# Altium schematic sheet Control_Sense_TOPMOS.SchDoc (part 1 of 4)
size A2 portrait; SheetNumber: 3; SheetTotal: 5
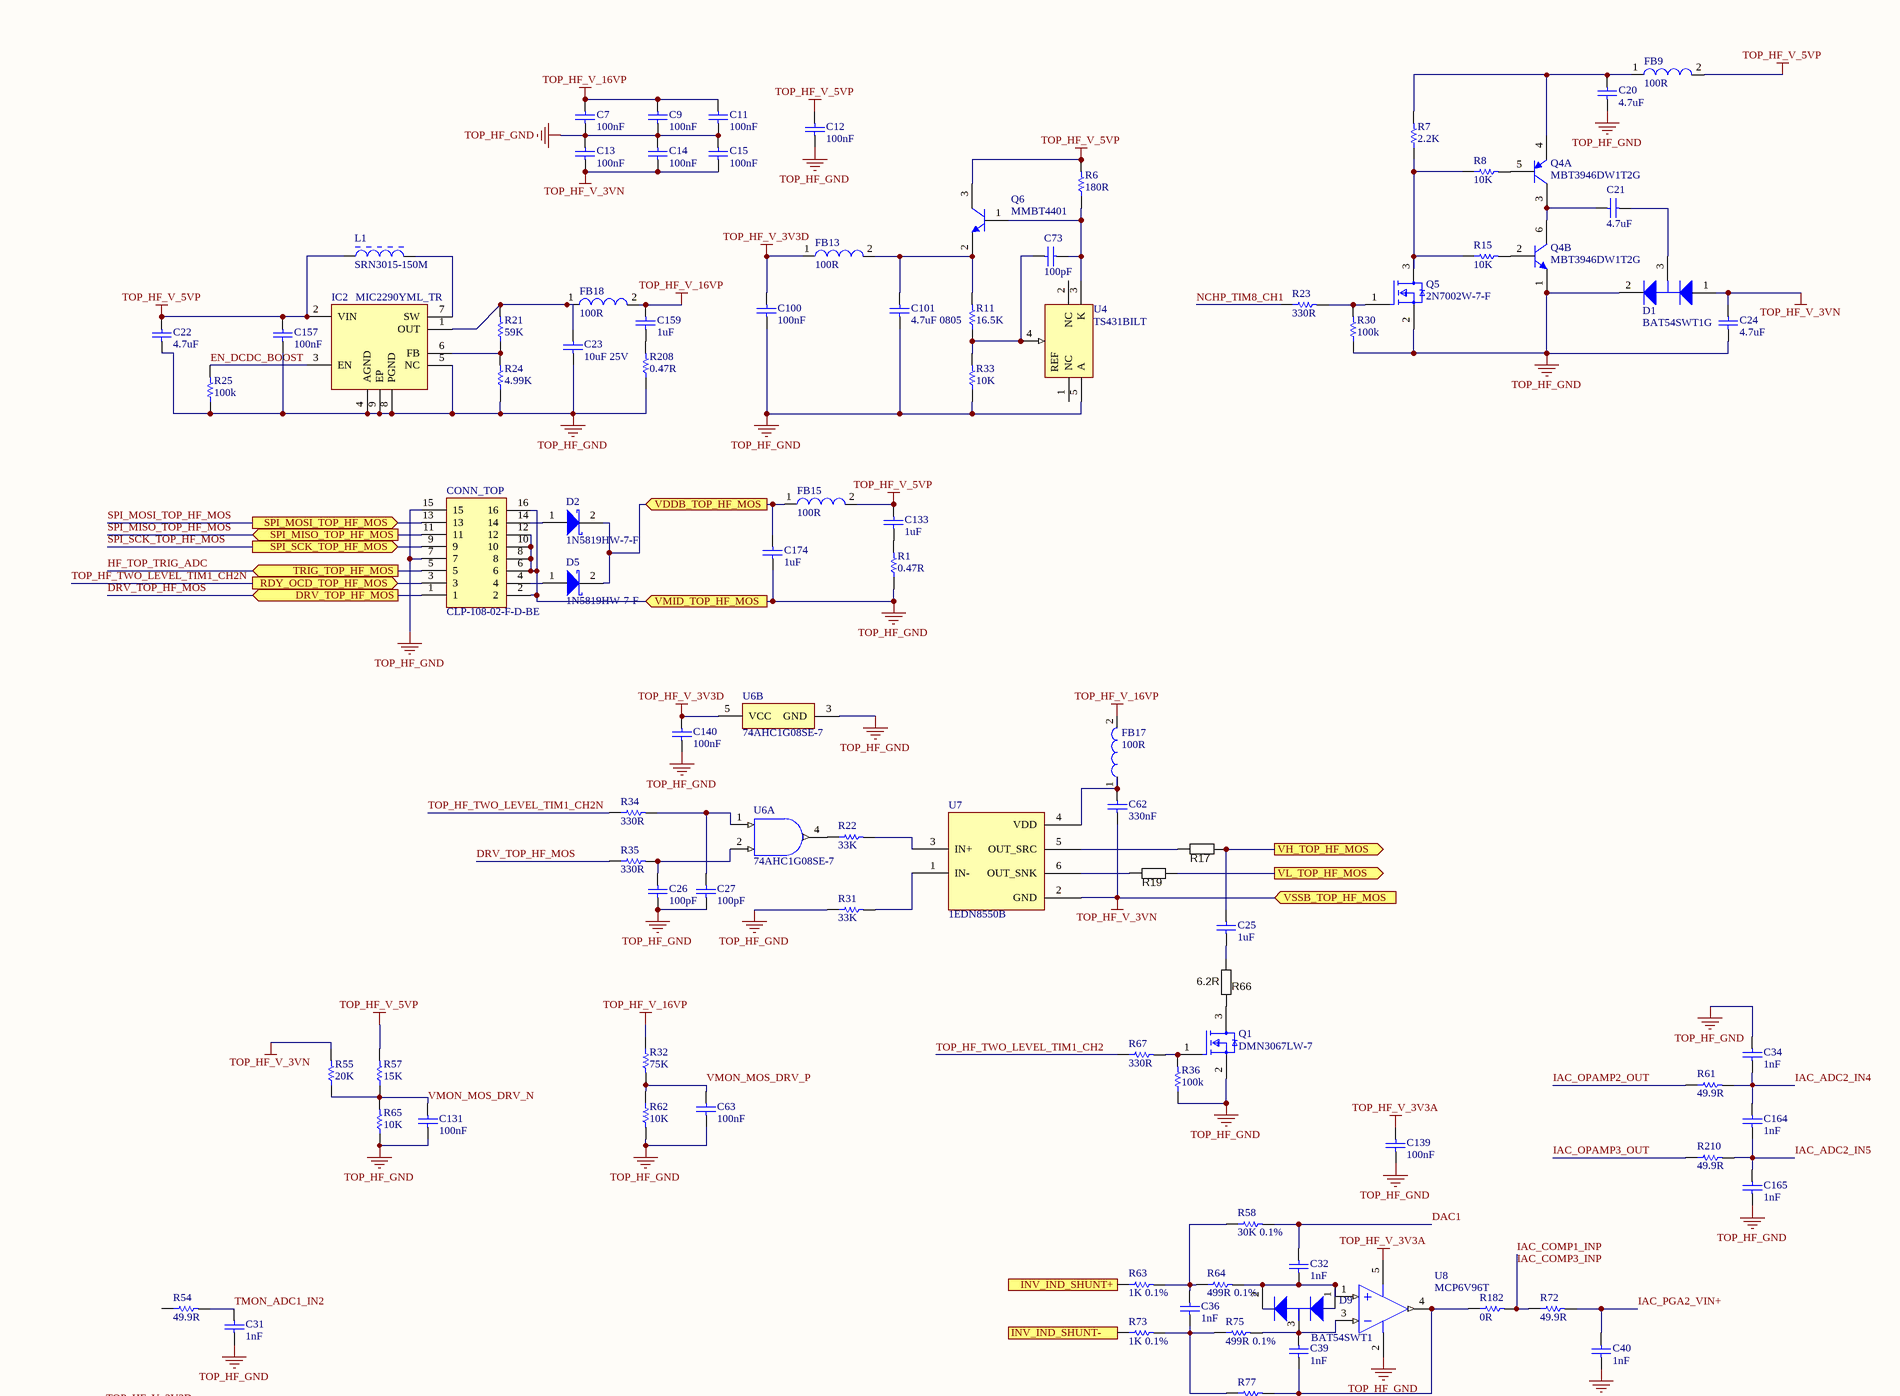
[diagram p0: Control_Sense_TOPMOS.SchDoc, top]
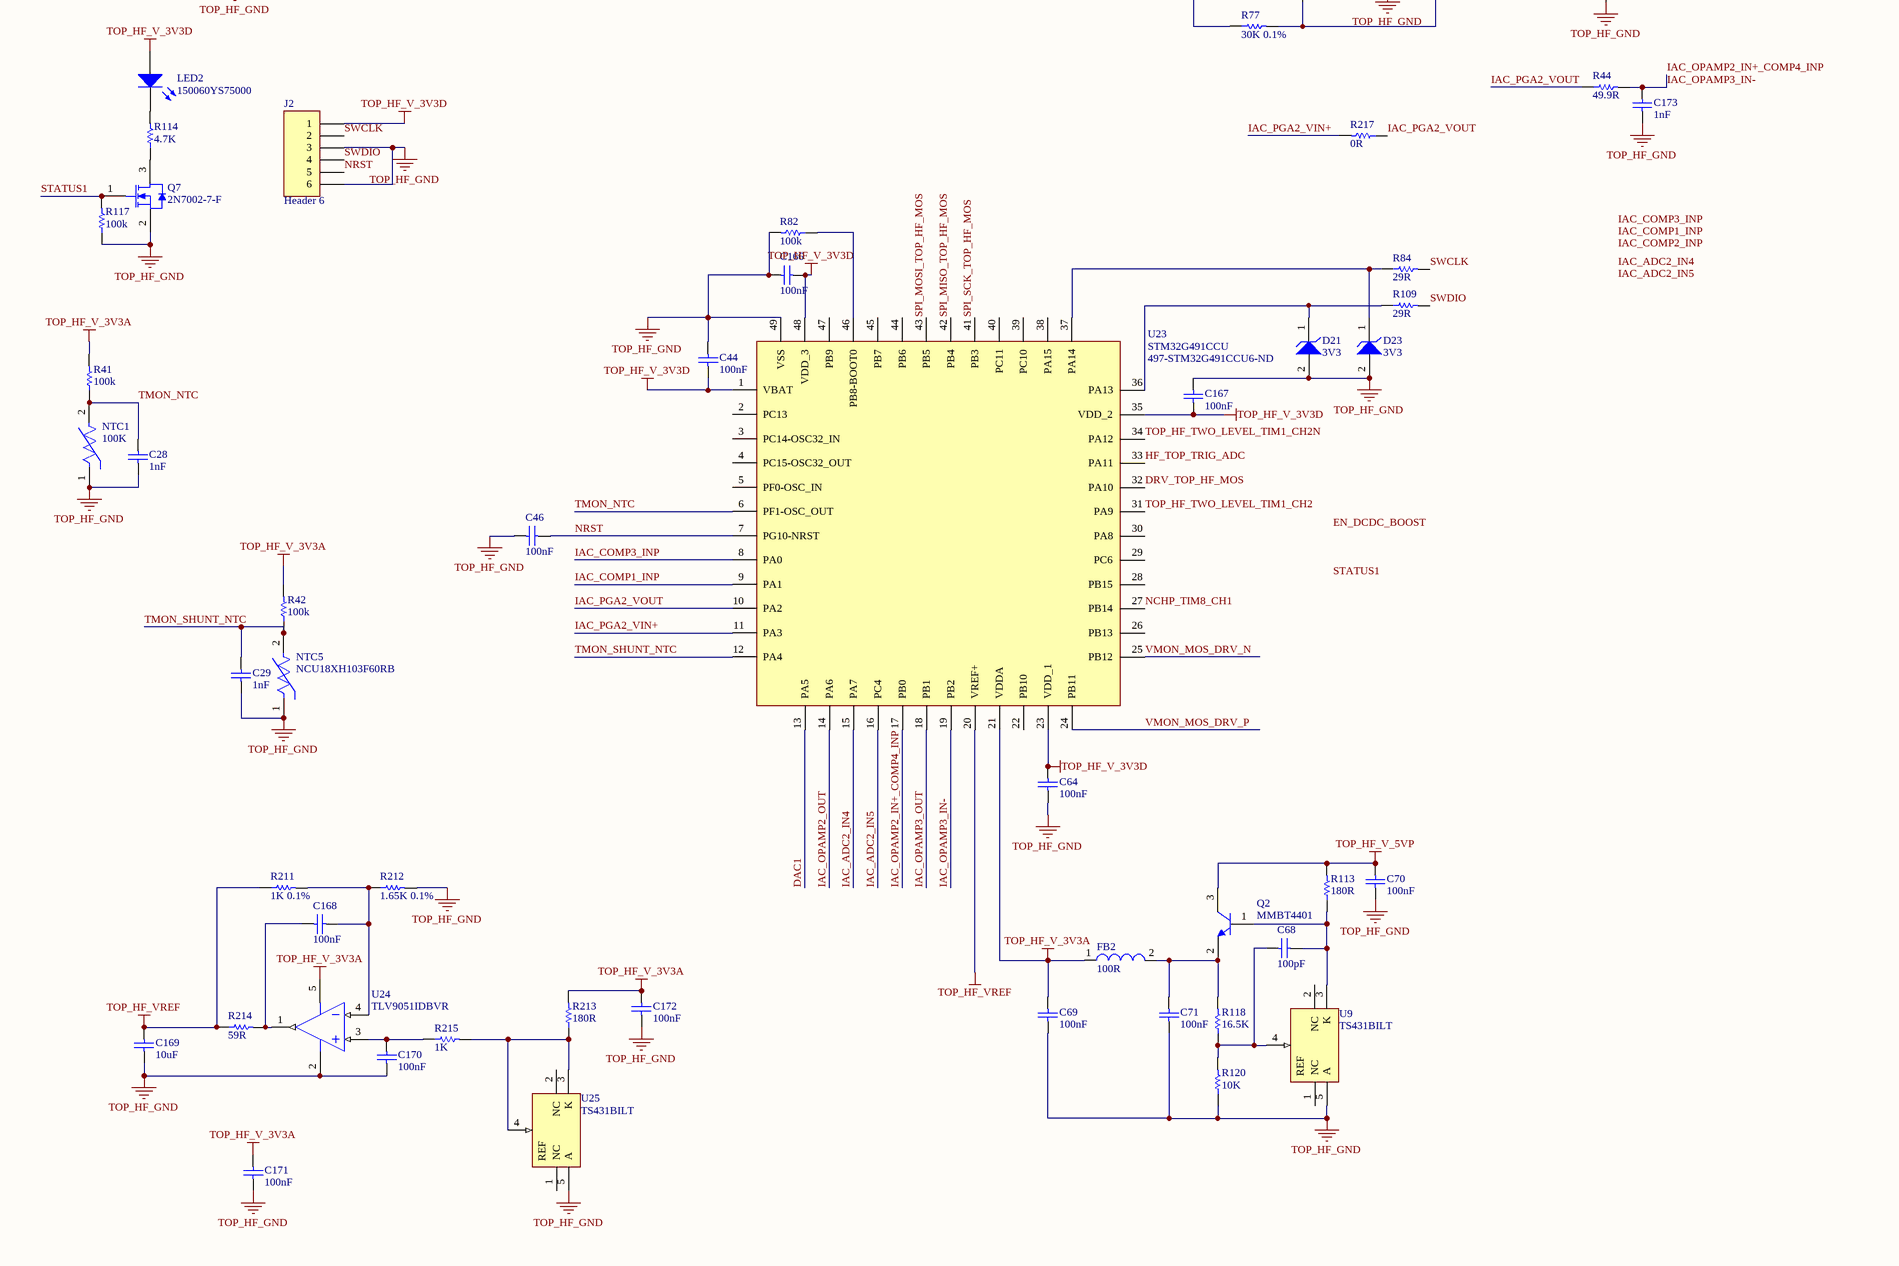
[diagram p1: Control_Sense_TOPMOS.SchDoc, bottom]

## Parts
C7  100nF  [CAPC1608X90X35ML15T15]
C9  100nF  [CAPC1608X90X35ML15T15]
C11  100nF  [CAPC1608X90X35NL15T15]
C12  100nF  [CAPC1608X90X35NL15T15]
C13  100nF  [CAPC1608X90X35ML15T15]
C14  100nF  [CAPC1608X90X35ML15T15]
C15  100nF  [CAPC1608X90X35NL15T15]
C20  4.7uF  [SAMS-C0603-2_L]
C21  4.7uF  [SAMS-C0603-2_L]
C22  4.7uF  [CAPC2013X145X20NL20]
C23  10uF 25V  [CAPC3216X229X50LL20T25]
C24  4.7uF  [SAMS-C0603-2_L]
C25  1uF  [CAPC2013X135X45ML10T25]
C26  100pF  [CAPC1608X90X35NL10T15]
C27  100pF  [CAPC1608X90X35NL10T15]
C28  1nF  [CAPC1005X56X25NL10T15]
C29  1nF  [CAPC1005X56X25NL10T15]
C31  1nF  [CAPC1005X56X25LL10T15]
C32  1nF  [CAPC1608X90X35NL15T15]
C34  1nF  [CAPC1005X56X25LL10T15]
C36  1nF  [CAPC1608X90X35LL15T15]
C39  1nF  [CAPC1608X90X35NL15T15]
C40  1nF  [CAPC1005X56X25LL10T15]
C44  100nF  [SAMS-C0603-2_N]
C46  100nF  [CAPC1005X56X25NL10T15]
C62  330nF  [CAPC2013X135X45NL10T25]
C63  100nF  [CAPC1005X56X25NL10T15]
C64  100nF  [SAMS-C0603-2_N]
C68  100pF  [CAPC1608X90X35NL10T15]
C69  100nF  [SAMS-C0603-2_L]
C70  100nF  [SAMS-C0603-2_N]
C71  100nF  [SAMS-C0603-2_N]
C73  100pF  [CAPC1608X90X35NL10T15]
C100  100nF  [SAMS-C0603-2_N]
C101  4.7uF 0805  [CAPC2013X145X20NL20]
C131  100nF  [CAPC1005X56X25NL10T15]
C133  1uF  [CAPC2013X140X50LL20T25]
C139  100nF  [SAMS-C0603-2_N]
C140  100nF  [CAPC1608X90X35LL15T15]
C157  100nF  [CAPC1608X90X35LL15T15]
C159  1uF  [CAPC2013X140X50LL20T25]
C164  1nF  [CAPC1005X56X25LL10T15]
C165  1nF  [CAPC1005X56X25LL10T15]
C166  100nF  [SAMS-C0603-2_N]
C167  100nF  [SAMS-C0603-2_N]
C168  100nF  [SAMS-C0603-2_L]
C169  10uF  [CAPC1608X90X35LL15T15]
C170  100nF  [SAMS-C0603-2_L]
C171  100nF  [SAMS-C0603-2_L]
C172  100nF  [SAMS-C0603-2_N]
C173  1nF  [CAPC1005X56X25LL10T15]
C174  1uF  [CAPC2013X140X50LL20T25]
CONN_TOP  CLP-108-02-F-D-BE  [CLP-108-02-XXX-D-BE]
D1  BAT54SWT1G  [ONSC-SOT-323-3-419-04_V]
D2  1N5819HW-7-F  [DIOD-SOD-123-2_V]
D5  1N5819HW-7-F  [DIOD-SOD-123-2_V]
D9  BAT54SWT1  [ONSC-SOT-323-3-419-04_V]
D21  3V3  [ONSC-SOD-523-2-502-01_V]
D23  3V3  [ONSC-SOD-523-2-502-01_V]
FB2  100R  [SMD-0603]
FB9  100R  [SMD-0603]
FB13  100R  [SMD-0603]
FB15  100R  [SMD-0603]
FB17  100R  [SMD-0603]
FB18  100R  [SMD-0603]
IC2  MIC2290YML_TR  [SON50P200X200X95-9N-D]
J2  Header 6  [HDR1X6]
L1  SRN3015-150M  [BOUR-SRN3015-2_V]
LED2  150060YS75000  [0603_A]
NTC1  100K  [FP-NXR_151B030-MFG]
NTC5  NCU18XH103F60RB  [FP-NCU18-0_15-MFG]
Q1  DMN3067LW-7  [FP-SOT323-IPC_C]
Q2  MMBT4401  [SOT23-3]
Q4  MBT3946DW1T2G  [ONSC-SC70-6-419B-02_W_V]  (parts A,B of 2)
Q5  2N7002W-7-F  [FP-SOT323-IPC_B]
Q6  MMBT4401  [SOT23-3]
Q7  2N7002-7-F  [DIOD-SOT23-3_V]
R1  0.47R  [RESC1608X55X25ML10T15]
R6  180R  [RESC1608X55X25LL10T15]
R7  2.2K  [RESC1608X55X25NL10T15]
R8  10K  [RESC1608X55X30NL20T10]
R11  16.5K  [RESC1608X55X30NL15T15]
R15  10K  [RESC1608X55X30NL20T10]
R17  RES_EMPTY_0805  [RESC2012X70N]  (value not drawn)
R19  RES_EMPTY_0805  [RESC2012X70N]  (value not drawn)
R21  59K  [RESC1608X55X30NL15T15]
R22  33K  [RESC1005X40X25ML05T05]
R23  330R  [RESC1608X55X25NL10T15]
R24  4.99K  [RESC1609X50X30NL10T20]
R25  100k  [RESC1608X55X30NL15T15]
R30  100k  [RESC1608X55X30NL15T15]
R31  33K  [RESC1005X40X25ML05T05]
R32  75K  [RESC1608X55X30NL15T15]
R33  10K  [RESC1609X55X30LL15T15]
R34  330R  [RESC1608X55X25NL10T15]
R35  330R  [RESC1608X55X25NL10T15]
R36  100k  [RESC1608X55X30NL15T15]
R41  100k  [RESC1608X55X30NL15T15]
R42  100k  [RESC1608X55X30NL15T15]
R44  49.9R  [RESC1005X40X25NL05T05]
R54  49.9R  [RESC1005X40X25NL05T05]
R55  20K  [RESC1608X55X30NL20T10]
R57  15K  [RESC1608X55X30NL20T10]
R58  30K 0.1%  [RESC1608X55N]
R61  49.9R  [RESC1005X40X25NL05T05]
R62  10K  [RESC1608X55X30NL20T10]
R63  1K 0.1%  [RESC1608X55X25NL10T15]
R64  499R 0.1%  [RESC1608X55N]
R65  10K  [RESC1608X55X30NL20T10]
R66  6.2R  [RESC2012X70N]
R67  330R  [RESC1608X55X25NL10T15]
R72  49.9R  [RESC1005X40X25NL05T05]
R73  1K 0.1%  [RESC1608X55X25NL10T15]
R75  499R 0.1%  [RESC1608X55N]
R77  30K 0.1%  [RESC1608X55N]
R82  100k  [RESC1608X55X30NL15T15]
R84  29R  [RESC1608X55X30NL20T10]
R109  29R  [RESC1608X55X30NL20T10]
R113  180R  [RESC1608X55X25LL10T15]
R114  4.7K  [RESC1608X55X25ML10T15]
R117  100k  [RESC1608X55X25ML10T15]
R118  16.5K  [RESC1608X55X30NL15T15]
R120  10K  [RESC1609X55X30LL15T15]
R182  0R  [RESC1608X55X25NL10T15]
R208  0.47R  [RESC1608X55X25ML10T15]
R210  49.9R  [RESC1005X40X25NL05T05]
R211  1K 0.1%  [RESC1608X55X30LL20T20]
R212  1.65K 0.1%  [RESC1608X55X30LL20T20]
R213  180R  [RESC1608X55X25LL10T15]
R214  59R  [RESC1608X55X30NL15T15]
R215  1K  [RESC1608X55X30LL20T10]
R217  0R  [RESC1005X40X25NL05T05]
U4  TS431BILT  [SOT23-5]
U6  74AHC1G08SE-7  [DCK0005A_M]  (parts A,B of 2)
U7  1EDN8550B  [SOT23-6]
U8  MCP6V96T  [DCK0005A_N]
U9  TS431BILT  [SOT23-5]
U23  STM32G491CCU  Supplier Part Number 1: 497-STM32G491CCU6-ND  [QFN50P700X700X65-49N-D]
U24  TLV9051IDBVR  [SOT23-5]
U25  TS431BILT  [SOT23-5]

## Ports
DRV_TOP_HF_MOS (in), INV_IND_SHUNT+ (in), INV_IND_SHUNT- (in), RDY_OCD_TOP_HF_MOS (out), SPI_MISO_TOP_HF_MOS (in), SPI_MOSI_TOP_HF_MOS (out), SPI_SCK_TOP_HF_MOS (out), TRIG_TOP_HF_MOS (in), VDDB_TOP_HF_MOS (in), VH_TOP_HF_MOS (out), VL_TOP_HF_MOS (out), VMID_TOP_HF_MOS (in), VSSB_TOP_HF_MOS (in)

## Nets
TOP_HF_GND: C7.1 C9.1 C11.1 C12.1 C13.2 C14.2 C15.2 C20.1 C22.1 C23.1 C24.1 C26.1 C27.1 C28.1 C29.1 C31.1 C34.2 C40.1 C44.2 C46.1 C63.1 C64.1 C69.1 C70.1 C71.1 C100.1 C101.1 C131.1 C139.1 C140.1 C157.1 C165.1 C166.2 C167.2 C169.1 C170.1 C171.1 C172.1 C173.1 C174.1 CONN_TOP.2 CONN_TOP.6 CONN_TOP.7 CONN_TOP.8 CONN_TOP.10 CONN_TOP.12 CONN_TOP.15 CONN_TOP.16 D1.2(K) D21.2(A) D23.2(A) IC2.4(AGND) IC2.5(NC) IC2.8(PGND) IC2.9(EP) J2.3 J2.6 NTC1.1 NTC5.1 Q1.2(S) Q4.1(E) Q5.2(S) Q7.2(S) R1.1 R24.1 R25.1 R30.1 R31.1 R33.1 R36.1 R62.2 R65.1 R82.2 R117.1 R120.1 R208.1 R212.2 U4.5(A) U6.3(GND) U8.2(V-) U9.5(A) U23.49(VSS) U24.2(VSS) U25.5(A) ; port VMID_TOP_HF_MOS
TOP_HF_V_3V3A: C69.2 C139.2 C171.2 C172.2 FB2.1 R41.2 R42.2 R213.2 U8.5(V+) U23.21(VDDA) U24.5(VDD)
TOP_HF_V_3V3D: C44.1 C64.2 C100.2 C140.2 C166.1 C167.1 FB13.1 J2.1 LED2.2(A) U6.5(VCC) U23.1(VBAT) U23.23(VDD_1) U23.35(VDD_2) U23.48(VDD_3)
TOP_HF_V_3VN: C13.1 C14.1 C15.1 C24.2 C62.1 D1.1(A) R55.2 U7.2(GND) ; port VSSB_TOP_HF_MOS
TOP_HF_V_5VP: C12.2 C22.2 C70.2 C133.2 C157.2 FB9.2 FB15.2 IC2.2(VIN) L1.1 Q2.3(C) Q6.3(C) R6.2 R57.2 R113.2
TOP_HF_V_16VP: C7.2 C9.2 C11.2 C159.2 FB17.2 FB18.2 R32.1
TOP_HF_VREF: C169.2 R211.1 R214.1 U23.20(VREF+)
DAC1: C32.2 R58.2 U23.13(PA5)
DRV_TOP_HF_MOS: CONN_TOP.1 R35.1 U23.32(PA10) ; port DRV_TOP_HF_MOS
EN_DCDC_BOOST: IC2.3(EN) R25.2
HF_TOP_TRIG_ADC: CONN_TOP.5 U23.33(PA11) ; port TRIG_TOP_HF_MOS
IAC_ADC2_IN4: C34.1 C164.2 R61.2 U23.15(PA7)
IAC_ADC2_IN5: C164.1 C165.2 R210.2 U23.16(PC4)
IAC_COMP1_INP: R72.1 R182.2 U23.8(PA0) U23.9(PA1)  [also labelled IAC_COMP3_INP]
IAC_OPAMP2_IN+_COMP4_INP: C173.2 R44.2 U23.17(PB0) U23.19(PB2)  [also labelled IAC_OPAMP3_IN-]
IAC_OPAMP2_OUT: R61.1 U23.14(PA6)
IAC_OPAMP3_OUT: R210.1 U23.18(PB1)
IAC_PGA2_VIN+: C40.2 R72.2 R217.2 U23.11(PA3)
IAC_PGA2_VOUT: R44.1 R217.1 U23.10(PA2)
INV_IND_SHUNT+: R63.1 ; port INV_IND_SHUNT+
INV_IND_SHUNT-: R73.1 ; port INV_IND_SHUNT-
NCHP_TIM8_CH1: R23.1 U23.27(PB14)
NRST: C46.2 J2.5 U23.7(PG10-NRST)
SPI_MISO_TOP_HF_MOS: CONN_TOP.11 U23.42(PB4) ; port SPI_MISO_TOP_HF_MOS
SPI_MOSI_TOP_HF_MOS: CONN_TOP.13 U23.43(PB5) ; port SPI_MOSI_TOP_HF_MOS
SPI_SCK_TOP_HF_MOS: CONN_TOP.9 U23.41(PB3) ; port SPI_SCK_TOP_HF_MOS
STATUS1: Q7.1(G) R117.2
SWCLK: J2.2 R84.2
SWDIO: J2.4 R109.2
TMON_ADC1_IN2: C31.2 R54.2
TMON_NTC: C28.2 NTC1.2 R41.1 U23.6(PF1-OSC_OUT)
TMON_SHUNT_NTC: C29.2 NTC5.2 R42.1 U23.12(PA4)
TOP_HF_TWO_LEVEL_TIM1_CH2: R67.1 U23.31(PA9)
TOP_HF_TWO_LEVEL_TIM1_CH2N: CONN_TOP.3 R34.1 U23.34(PA12) ; port RDY_OCD_TOP_HF_MOS
VDDB_TOP_HF_MOS: C174.2 D2.2(K) D5.2(K) FB15.1 ; port VDDB_TOP_HF_MOS
VH_TOP_HF_MOS: C25.2 R17.2 ; port VH_TOP_HF_MOS
VL_TOP_HF_MOS: R19.2 ; port VL_TOP_HF_MOS
VMON_MOS_DRV_N: C131.2 R55.1 R57.1 R65.2 U23.25(PB12)
VMON_MOS_DRV_P: C63.2 R32.2 R62.1 U23.24(PB11)
NetC20_2: C20.2 FB9.1 Q4.4(E) R7.2
NetC21_1: C21.1 D1.3(K/A)
NetC21_2: C21.2 Q4.3(C) Q4.6(C)
NetC23_2: C23.2 FB18.1 IC2.1(OUT) R21.2
NetC25_1: C25.1 R66.2
NetC26_2: C26.2 R35.2 U6.2(B)
NetC27_2: C27.2 R34.2 U6.1(A)
NetC32_1: C32.1 D9.1(A) D9.2(K) R64.2 U8.1(IN+)
NetC36_1: C36.1 R73.2 R75.1 R77.1
NetC36_2: C36.2 R58.1 R63.2 R64.1
NetC39_1: C39.1 D9.3(K/A) R75.2 U8.3(IN-)
NetC39_2: C39.2 R77.2 R182.1 U8.4(OUT)
NetC62_2: C62.2 FB17.1 U7.4(VDD)
NetC68_1: C68.1 R118.1 R120.2 U9.4(REF)
NetC68_2: C68.2 Q2.1(B) R113.1 U9.3(K)
NetC71_2: C71.2 FB2.2 Q2.2(E) R118.2
NetC73_1: C73.1 R11.1 R33.2 U4.4(REF)
NetC73_2: C73.2 Q6.1(B) R6.1 U4.3(K)
NetC101_2: C101.2 FB13.2 Q6.2(E) R11.2
NetC133_1: C133.1 R1.2
NetC159_1: C159.1 R208.2
NetC168_1: C168.1 R211.2 R212.1 U24.4(VIN-)
NetC168_2: C168.2 R214.2 U24.1(VOUT)
NetC170_2: C170.2 R215.1 U24.3(VIN+)
NetCONN_TOP_4: CONN_TOP.4 D5.1(A)
NetCONN_TOP_14: CONN_TOP.14 D2.1(A)
NetD21_1: D21.1(K) R109.1 U23.36(PA13)
NetD23_1: D23.1(K) R84.1 U23.37(PA14)
NetIC2_6: IC2.6(FB) R21.1 R24.2
NetIC2_7: IC2.7(SW) L1.2
NetLED2_1: LED2.1(K) R114.2
NetQ1_1: Q1.1(G) R36.2 R67.2
NetQ1_3: Q1.3(D) R66.1
NetQ4_2: Q4.2(B) R15.2
NetQ4_5: Q4.5(B) R8.2
NetQ5_1: Q5.1(G) R23.2 R30.2
NetQ5_3: Q5.3(D) R7.1 R8.1 R15.1
NetQ7_3: Q7.3(D) R114.1
NetR17_1: R17.1 U7.5(OUT_SRC)
NetR19_1: R19.1 U7.6(OUT_SNK)
NetR22_1: R22.1 U6.4(Y)
NetR22_2: R22.2 U7.3(IN+)
NetR31_2: R31.2 U7.1(IN-)
NetR82_1: R82.1 U23.46(PB8-BOOT0)
NetR213_1: R213.1 R215.2 U25.3(K) U25.4(REF)

Not connected (* = marked no-connect by the designer): R54 1; U4 1(NC) 2(NC); U9 1(NC) 2(NC); U23 2(PC13) 3(PC14-OSC32_IN) 4(PC15-OSC32_OUT) 5(PF0-OSC_IN) 22(PB10) 26(PB13) 28(PB15) 29(PC6) 30(PA8) 38(PA15) 39(PC10) 40(PC11) 44(PB6) 45(PB7) 47(PB9); U25 1(NC) 2(NC)

## Notes on the sheet
- Labels drawn without touching a wire or pin: EN_DCDC_BOOST, IAC_ADC2_IN4, IAC_ADC2_IN5, IAC_COMP1_INP, IAC_COMP2_INP, IAC_COMP3_INP, STATUS1